# EAGLE schematic Master (EAGLE 7.5.0)
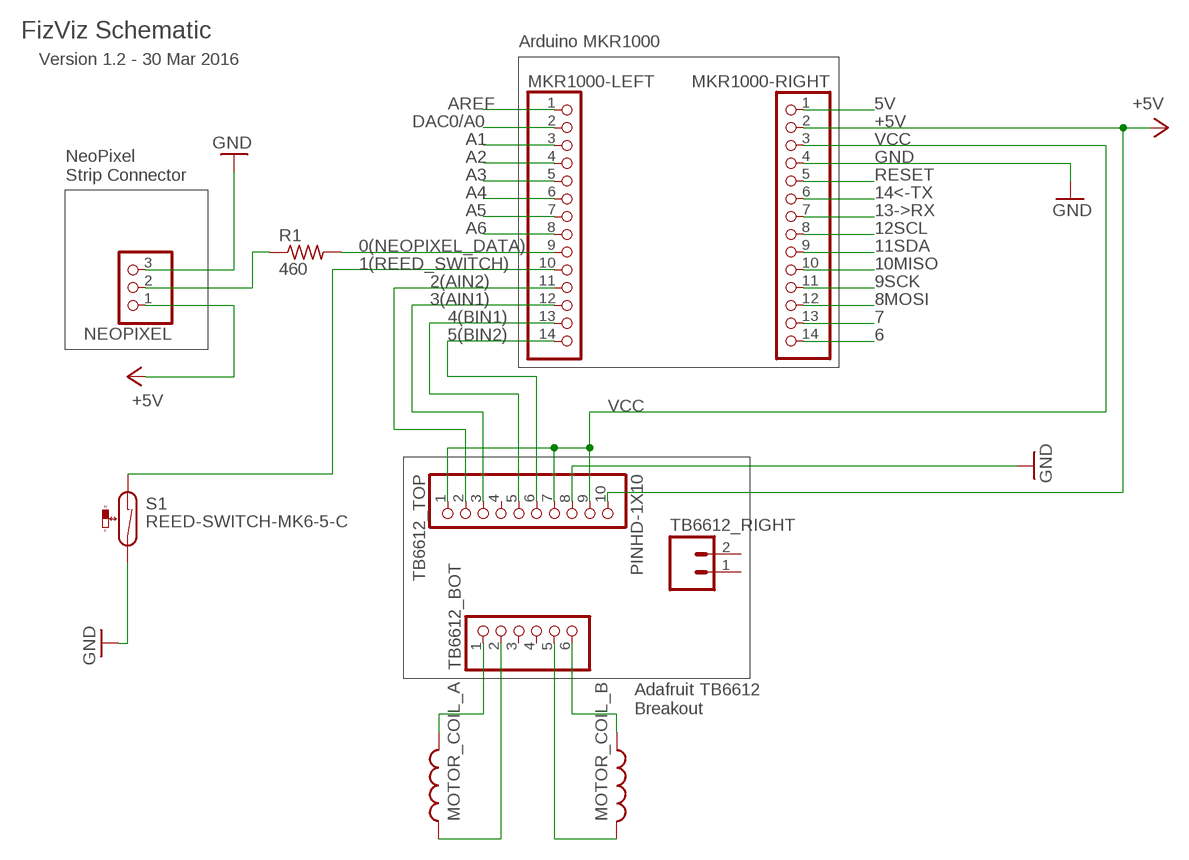
[diagram p0: schematic, sheet 1]

## Parts
MKR1000-LEFT  PINHD-1X14  [1X14]
MKR1000-RIGHT  PINHD-1X14  [1X14]
MOTOR_COIL_A  L-US0204/5  [0204/5]
MOTOR_COIL_B  L-US0204/5  [0204/5]
NEOPIXEL  PINHD-1X3  [1X03]
R1  460  R-US_0204/5  [0204/5]
S1  REED-SWITCH-MK6-5-C  [MK6-5]
TB6612_BOT  PINHD-1X6B  [1X06-BIG]
TB6612_RIGHT  M02PTH  [1X02]
TB6612_TOP  PINHD-1X10  [1X10-BIG]

## Nets
0(NEOPIXEL_DATA): MKR1000-LEFT.9 R1.2
1(REED_SWITCH): MKR1000-LEFT.10 S1.1
2(AIN2): MKR1000-LEFT.11 TB6612_TOP.2
3(AIN1): MKR1000-LEFT.12 TB6612_TOP.3
4(BIN1): MKR1000-LEFT.13 TB6612_TOP.5
5(BIN2): MKR1000-LEFT.14 TB6612_TOP.6
5V: MKR1000-RIGHT.1
6: MKR1000-RIGHT.14
7: MKR1000-RIGHT.13
8MOSI: MKR1000-RIGHT.12
9SCK: MKR1000-RIGHT.11
10MISO: MKR1000-RIGHT.10
11SDA: MKR1000-RIGHT.9
12SCL: MKR1000-RIGHT.8
13->RX: MKR1000-RIGHT.7
14<-TX: MKR1000-RIGHT.6
+5V: MKR1000-RIGHT.2 NEOPIXEL.1 TB6612_TOP.10
A1: MKR1000-LEFT.3
A2: MKR1000-LEFT.4
A3: MKR1000-LEFT.5
A4: MKR1000-LEFT.6
A5: MKR1000-LEFT.7
A6: MKR1000-LEFT.8
AREF: MKR1000-LEFT.1
DAC0/A0: MKR1000-LEFT.2
GND: MKR1000-RIGHT.4 NEOPIXEL.3 S1.2 TB6612_TOP.8
N$1: MOTOR_COIL_A.1 TB6612_BOT.1
N$2: MOTOR_COIL_A.2 TB6612_BOT.2
N$3: MOTOR_COIL_B.2 TB6612_BOT.5
N$4: MOTOR_COIL_B.1 TB6612_BOT.6
N$6: NEOPIXEL.2 R1.1
RESET: MKR1000-RIGHT.5
VCC: MKR1000-RIGHT.3 TB6612_TOP.1 TB6612_TOP.7 TB6612_TOP.9
Unconnected: TB6612_BOT.3 TB6612_BOT.4 TB6612_RIGHT.1 TB6612_RIGHT.2 TB6612_TOP.4

## Notes on the sheet
- FizViz Schematic
- Arduino MKR1000
- Version 1.2 - 30 Mar 2016
- NeoPixel
  Strip Connector
- Adafruit TB6612
  Breakout

## Library data of the parts
MKR1000-LEFT MKR1000-RIGHT = adafruit:PINHD-1X14: PIN HEADER
MOTOR_COIL_A MOTOR_COIL_B = resistor:L-US: INDUCTOR, American symbol
NEOPIXEL = adafruit:PINHD-1X3: PIN HEADER
R1 = adafruit:R-US_: RESISTOR, American symbol
S1 = switch-reed:REED-SWITCH-: Reed Sensor; MF: MEDER; MPN: MK6-5-C; OC_FARNELL: 1079480
TB6612_BOT = adafruit:PINHD-1X6: PIN HEADER
TB6612_RIGHT = SparkFun-Connectors:M02: Standard 2-pin 0.1" header. Use with - straight break away headers ( PRT-00116) - right angle break away headers (PRT-00553) - swiss pins (PRT-00743) - machine pins (PRT-00117) - female headers (PRT-00115) Molex polarized connector foot print use with: PRT-08233 with associated crimp pins and housings. 2.54_SCREWTERM for use with PRT-10571. 3.5mm Screw Terminal footprints for PRT-08084 5mm Screw Terminal footprints for use with PRT-08432
TB6612_TOP = adafruit:PINHD-1X10: Pin header 1x10 0.1" spacing With round pins